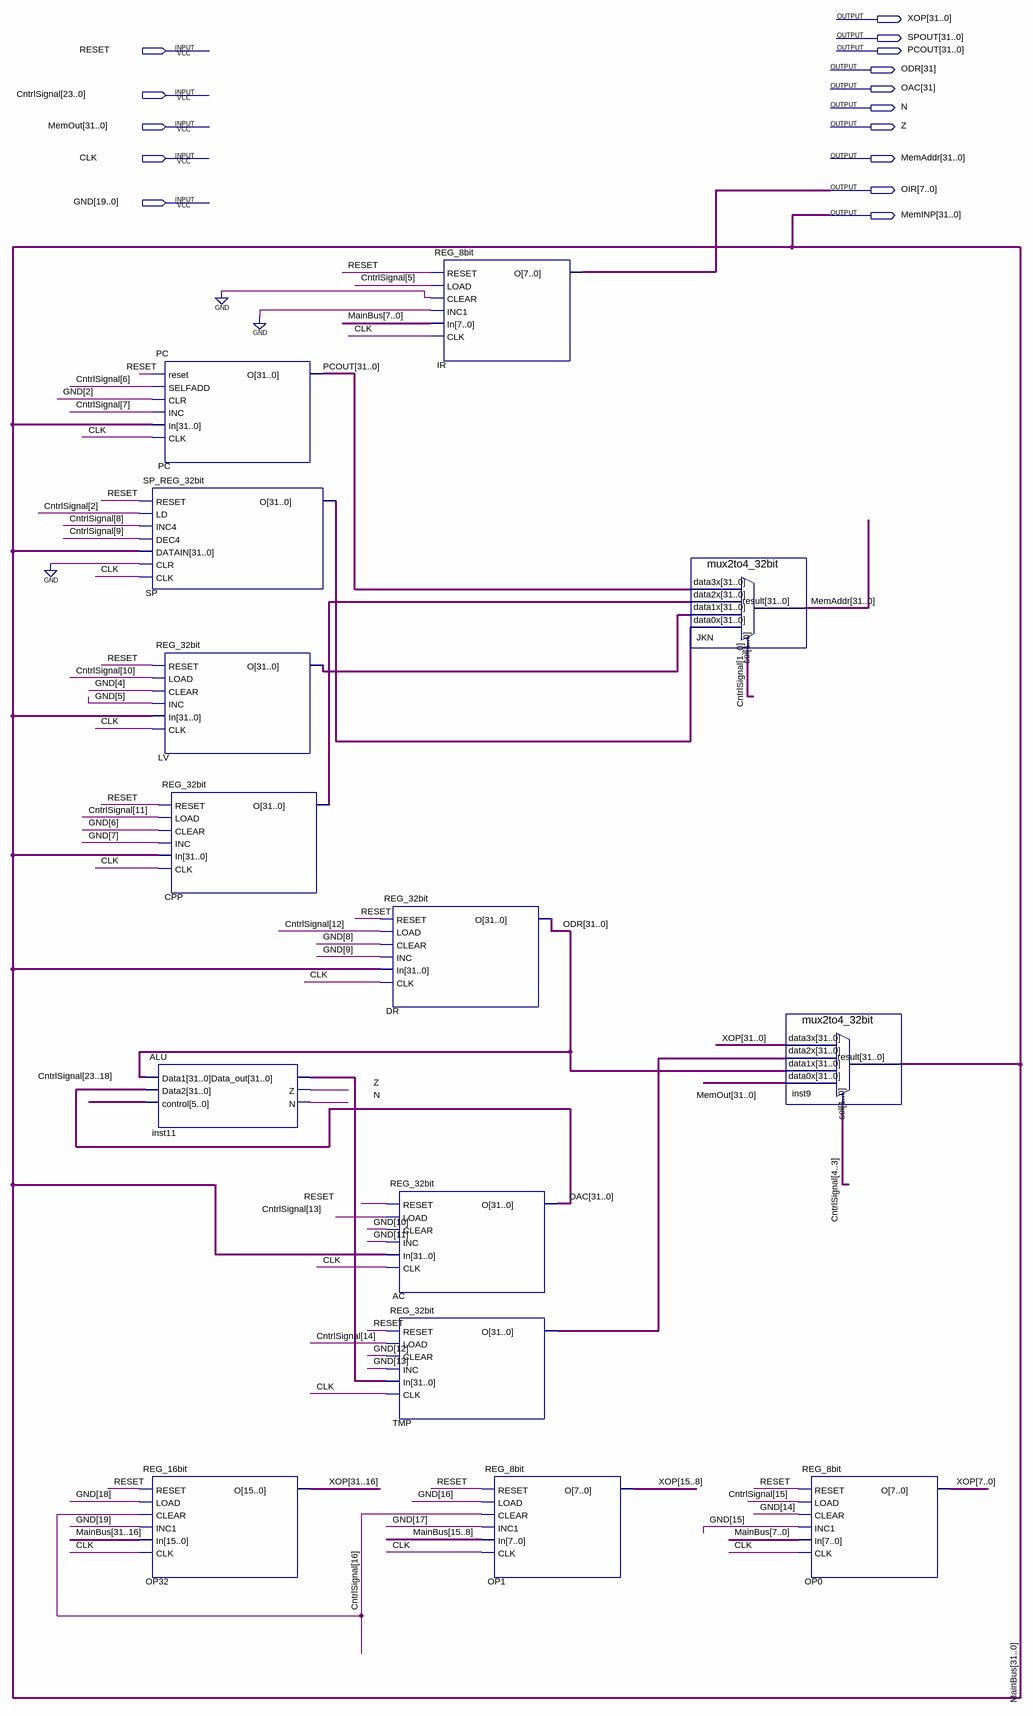
[diagram p0: schematic sheet]
// Quartus schematic DataPath.bdf as structural Verilog: 14 symbols, 15 pins
module DataPath (
  input  RESET,
  input  [23:0] CntrlSignal,
  input  [31:0] MemOut,
  input  CLK,
  input  [19:0] GND,
  output [31:0] XOP,
  output [31:0] SPOUT,
  output [31:0] PCOUT,
  output [31:0] ODR,
  output [31:0] OAC,
  output N,
  output Z,
  output [31:0] MemAddr,
  output [7:0] OIR,
  output [31:0] MemINP
);

  wire [31:0] CPP_o, inst11_data_out, LV_o, SP_o, TMP_o;

  SP_REG_32bit SP (
    .RESET(RESET), .LD(CntrlSignal[2]), .INC4(CntrlSignal[8]), .DEC4(CntrlSignal[9]), .DATAIN(MemINP),
    .CLR(1'b0), .CLK(CLK), .O(SP_o));
  REG_16bit OP32 (
    .RESET(RESET), .LOAD(GND[18]), .CLEAR(CntrlSignal[16]), .INC1(GND[19]), .In(MemINP[31:16]), .CLK(CLK),
    .O(XOP[31:16]));
  PC PC (
    .reset(RESET), .SELFADD(CntrlSignal[6]), .CLR(GND[2]), .INC(CntrlSignal[7]), .In(MemINP), .CLK(CLK),
    .O(PCOUT));
  REG_32bit LV (.RESET(RESET), .LOAD(CntrlSignal[10]), .CLEAR(GND[4]), .INC(GND[5]), .In(MemINP), .CLK(CLK), .O(LV_o));
  REG_32bit CPP (
    .RESET(RESET), .LOAD(CntrlSignal[11]), .CLEAR(GND[6]), .INC(GND[7]), .In(MemINP), .CLK(CLK), .O(CPP_o));
  ALU inst11 (.Data1(ODR), .Data2(OAC), .control(CntrlSignal[23:18]), .Data_out(inst11_data_out), .Z(Z), .N(N));
  REG_32bit DR (.RESET(RESET), .LOAD(CntrlSignal[12]), .CLEAR(GND[8]), .INC(GND[9]), .In(MemINP), .CLK(CLK), .O(ODR));
  REG_32bit AC (.RESET(RESET), .LOAD(CntrlSignal[13]), .CLEAR(GND[10]), .INC(GND[11]), .In(MemINP), .CLK(CLK), .O(OAC));
  REG_32bit TMP (
    .RESET(RESET), .LOAD(CntrlSignal[14]), .CLEAR(GND[12]), .INC(GND[13]), .In(inst11_data_out), .CLK(CLK),
    .O(TMP_o));
  REG_8bit IR (.RESET(RESET), .LOAD(CntrlSignal[5]), .CLEAR(1'b0), .INC1(1'b0), .In(MemINP[7:0]), .CLK(CLK), .O(OIR));
  REG_8bit OP1 (
    .RESET(RESET), .LOAD(GND[16]), .CLEAR(CntrlSignal[16]), .INC1(GND[17]), .In(MemINP[15:8]), .CLK(CLK),
    .O(XOP[15:8]));
  mux2to4_32bit JKN (
    .data3x(PCOUT), .data2x(CPP_o), .data1x(LV_o), .data0x(SP_o), .sel(CntrlSignal[1:0]), .result(MemAddr));
  mux2to4_32bit inst9 (
    .data3x(XOP), .data2x(TMP_o), .data1x(ODR), .data0x(MemOut), .sel(CntrlSignal[4:3]), .result(MemINP));
  REG_8bit OP0 (
    .RESET(RESET), .LOAD(CntrlSignal[15]), .CLEAR(GND[14]), .INC1(GND[15]), .In(MemINP[7:0]), .CLK(CLK),
    .O(XOP[7:0]));

  // Other names for the same wires on the sheet: MainBus[31:0] = MemINP
endmodule
